# EasyEDA schematic rapoukBoardv6.json
TITLE: rapoukBoardv3; REV: 0.0; Date: 28-04-24; Sheet: 1/1; Drawn By: Roman Suk; Company: Suk Industries
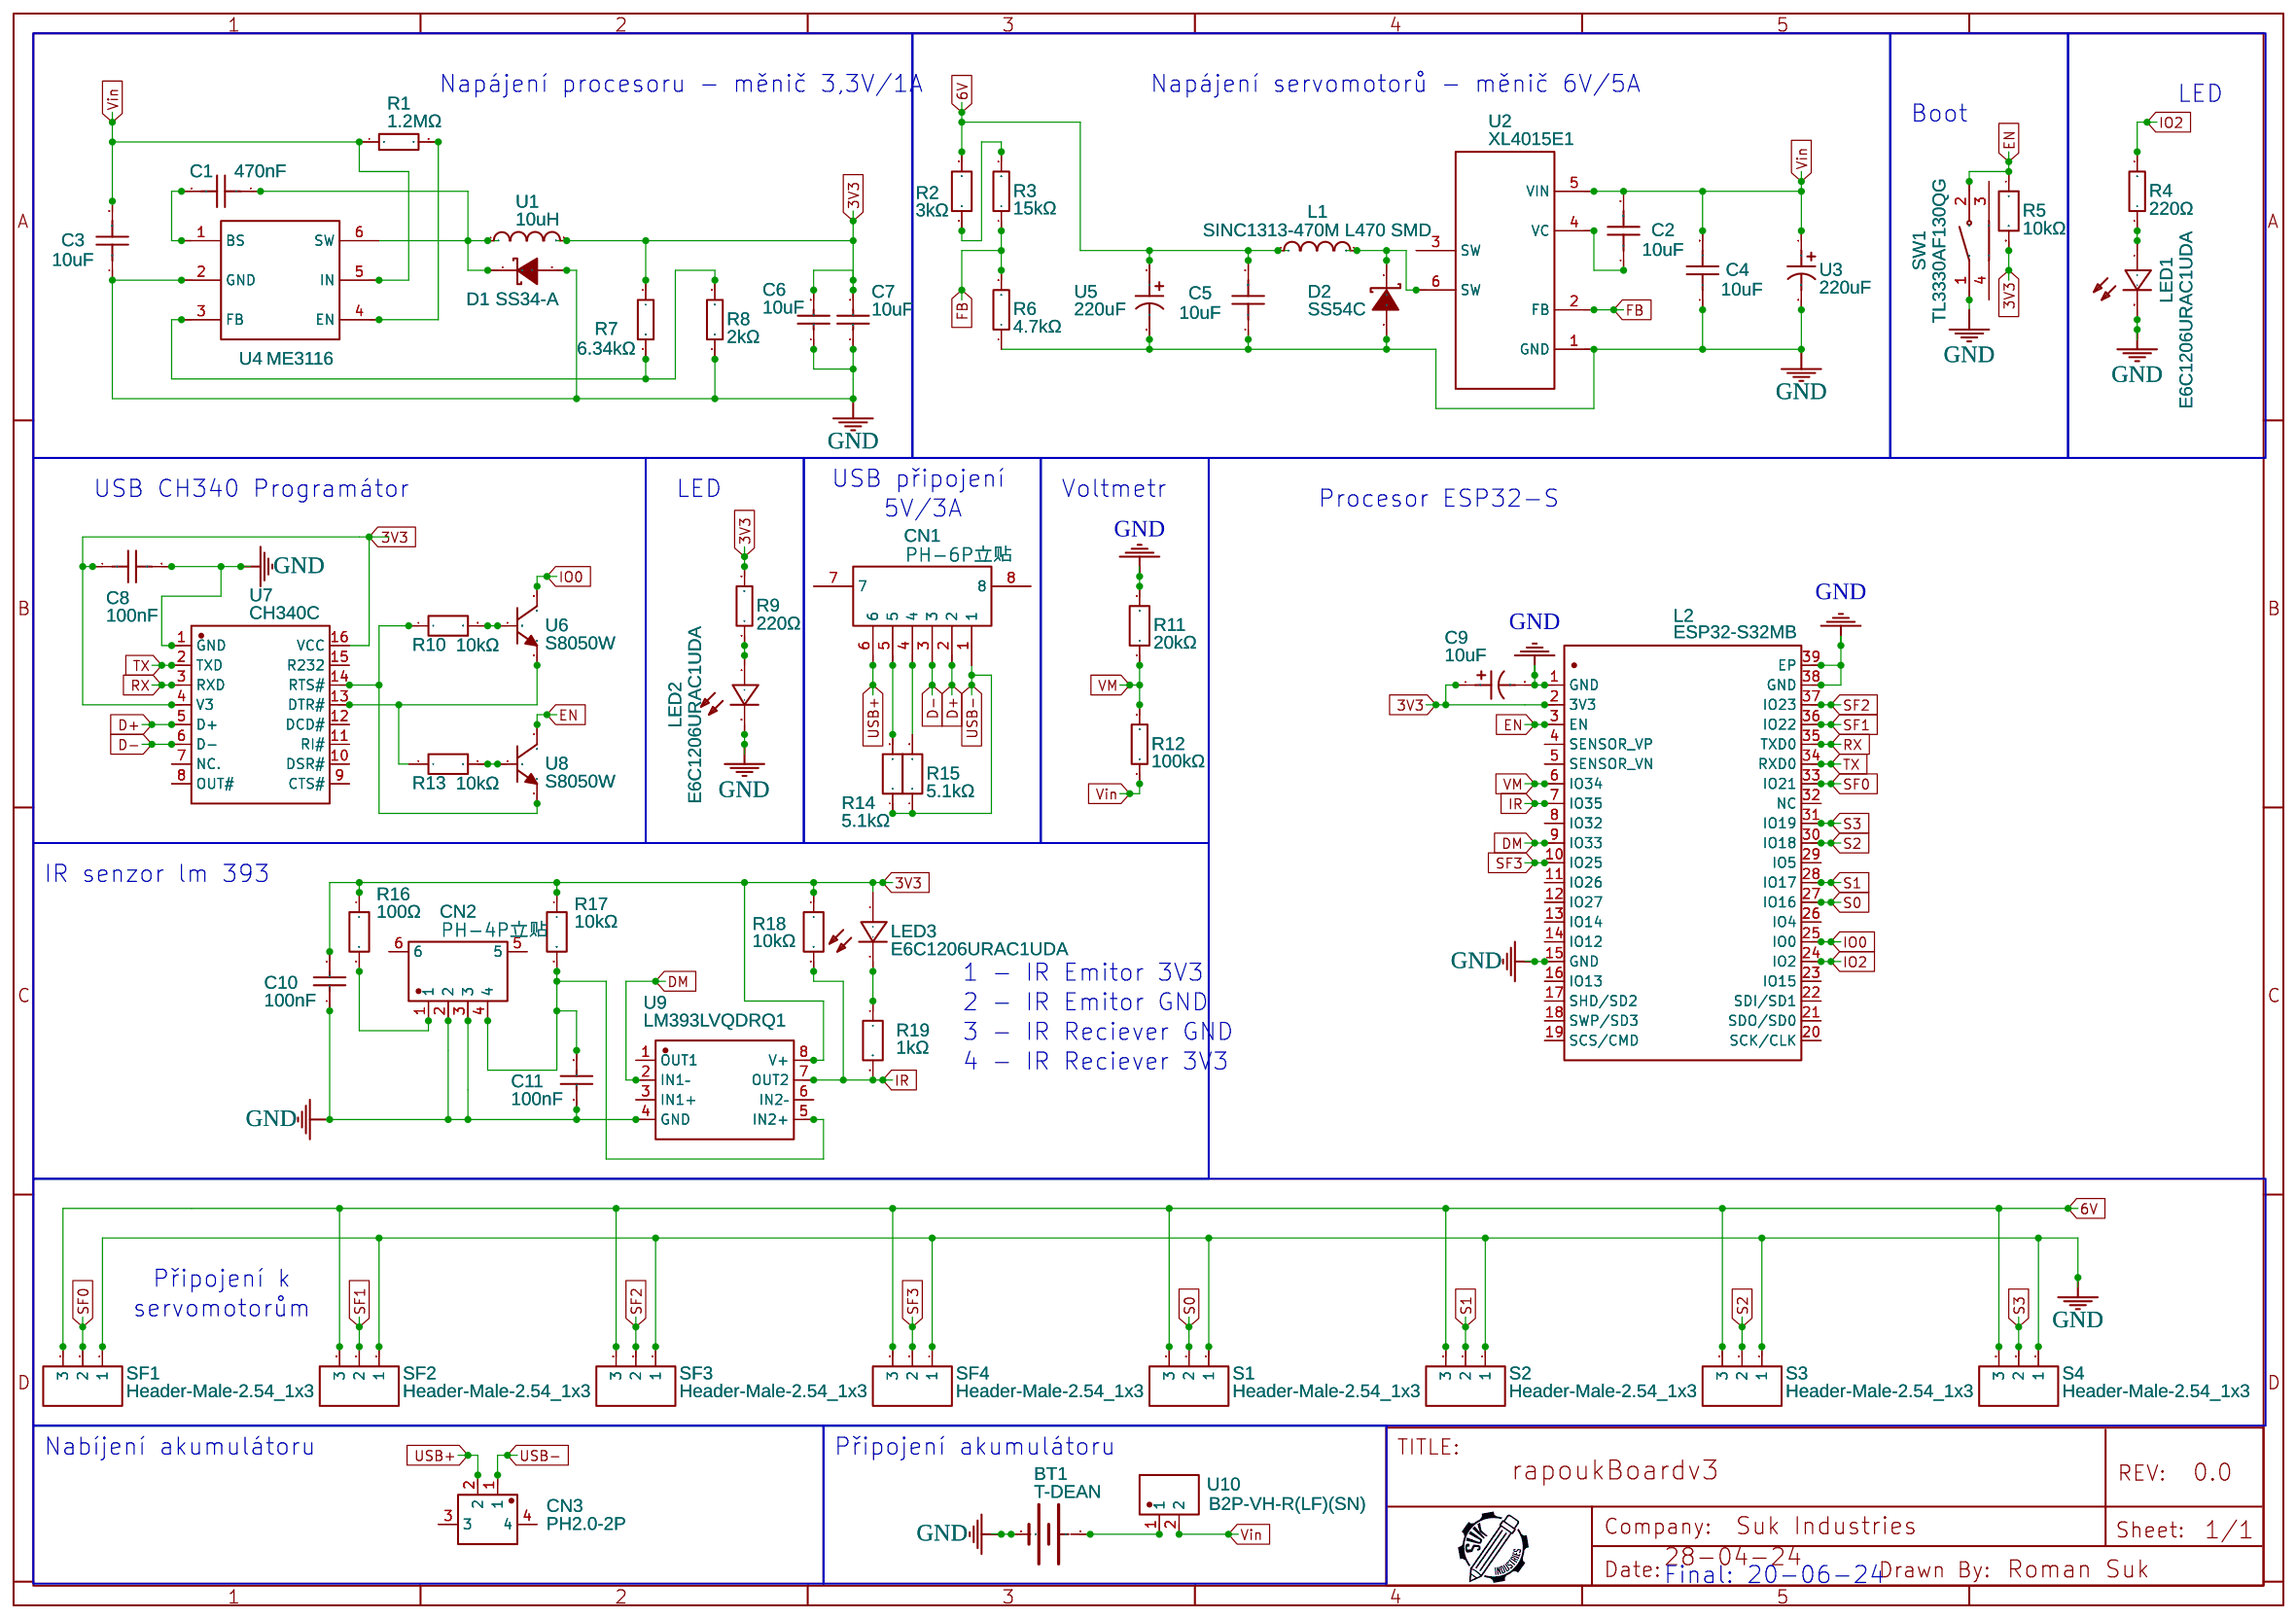
[diagram p0: schematic sheet]

## Parts
BT1  T-DEAN  [T_DEAN]
C1  470nF  [C1206]
C2  10uF  [C1206]
C3  10uF  [C1206]
C4  10uF  [C1206]
C5  10uF  [C1206]
C6  10uF  [C1206]
C7  10uF  [C1206]
C8  100nF  [C1206]
C9  10uF  [CAP-SMD_BD4.0-L4.3-W4.3-FD]
C10  100nF  [C1206]
C11  100nF  [C1206]
CN1  PH-6P立贴  [CONN-SMD_6P-P2.0-L14.0-W5.4]
CN2  PH-4P立贴  [CONN-SMD_PH2.0-4P]
CN3  PH2.0-2P  [CONN-SMD_PH2.0-1X2PW]
D1  SS34-A  [SMA_L4.3-W2.6-LS5.2-RD]
D2  SS54C  [SMC_L7.5-W5.8-LS8.3-RD]
L1  SINC1313-470M L470 SMD  [SINC1313]
L2  ESP32-S32MB  [WIFIM-SMD_ESP32-S32MB]
LED1  E6C1206URAC1UDA  [LED1206-R-RD_RED]
LED2  E6C1206URAC1UDA  [LED1206-R-RD_RED]
LED3  E6C1206URAC1UDA  [LED1206-R-RD_RED]
R1  1.2MΩ  [R1206]
R2  3kΩ  [R1206]
R3  15kΩ  [R1206]
R4  220Ω  [R1206]
R5  10kΩ  [R1206]
R6  4.7kΩ  [R1206]
R7  6.34kΩ  [R1206]
R8  2kΩ  [R1206]
R9  220Ω  [R1206]
R10  10kΩ  [R1206]
R11  20kΩ  [R1206]
R12  100kΩ  [R1206]
R13  10kΩ  [R1206]
R14  5.1kΩ  [R1206]
R15  5.1kΩ  [R1206]
R16  100Ω  [R1206]
R17  10kΩ  [R1206]
R18  10kΩ  [R1206]
R19  1kΩ  [R1206]
S1  Header-Male-2.54_1x3  [HDR-TH_3P-P2.54-V-M-1]
S2  Header-Male-2.54_1x3  [HDR-TH_3P-P2.54-V-M-1]
S3  Header-Male-2.54_1x3  [HDR-TH_3P-P2.54-V-M-1]
S4  Header-Male-2.54_1x3  [HDR-TH_3P-P2.54-V-M-1]
SF1  Header-Male-2.54_1x3  [HDR-TH_3P-P2.54-V-M-1]
SF2  Header-Male-2.54_1x3  [HDR-TH_3P-P2.54-V-M-1]
SF3  Header-Male-2.54_1x3  [HDR-TH_3P-P2.54-V-M-1]
SF4  Header-Male-2.54_1x3  [HDR-TH_3P-P2.54-V-M-1]
SW1  TL3330AF130QG  [SW-SMD_E-SWITCH_TL3330]
U1  10uH  [IND-SMD_L5.8-W5.2_CD54]
U2  XL4015E1  [TO-263-5_L10.2-W8.9-P1.70-TL]
U3  220uF  [CAP-SMD_BD6.3-L6.6-W6.6-FD]
U4  ME3116  [SOT-23-6_L2.9-W1.6-P0.95-LS2.8-BL]
U5  220uF  [CAP-SMD_BD6.3-L6.6-W6.6-FD]
U6  S8050W  [SOT-323-3_L2.1-W1.3-P1.30-LS2.3-BR]
U7  CH340C  [SOP-16_L10.0-W3.9-P1.27-LS6.0-BL]
U8  S8050W  [SOT-323-3_L2.1-W1.3-P1.30-LS2.3-BR]
U9  LM393LVQDRQ1  [SOIC-8_L4.9-W3.9-P1.27-LS6.0-BL]
U10  B2P-VH-R(LF)(SN)  [CONN-TH_B2P-VH-R]

## Library data of the parts
BT1 = T-DEAN: Contributor: michalklis
C1 = TCC1206X7R474K500FT: Contributor: LCSC; Supplier: LCSC; Supplier Part: C282872; Manufacturer: CCTC(三环); JLCPCB Part Class: Extended Part
C2-C5 = TCC1206X7R106K250HT: Contributor: LCSC; Supplier: LCSC; Supplier Part: C380364; Manufacturer: CCTC(三环); JLCPCB Part Class: Extended Part
C6 C7 = TMK316B7106KL-TD: Supplier: LCSC; Manufacturer: TAIYO YUDEN(太诱); Supplier Part: C92831; JLCPCB Part Class: Extended Part
C8 = 1206Y1000104KXR: Contributor: LCSC; Supplier: LCSC; Supplier Part: C2319128; Manufacturer: Knowles(楼氏); JLCPCB Part Class: Extended Part
C9 = RST10UF16V013: Supplier: LCSC; Supplier Part: C4747968; Manufacturer: KNSCHA(科尼盛); JLCPCB Part Class: Extended Part; Contributor: lcsc
C10 C11 = C1206X104K451T: Supplier: LCSC; Manufacturer: IHHEC(禾伸堂); Supplier Part: C106025; JLCPCB Part Class: Extended Part
CN1 = PH-6P立贴: Contributor: LCSC; Supplier: LCSC; Supplier Part: C64659; Manufacturer: BOOMELE(博穆精密); JLCPCB Part Class: Extended Part
CN2 = PH-4P立贴: Contributor: LCSC; Supplier: LCSC; Supplier Part: C67258; Manufacturer: BOOMELE(博穆精密); JLCPCB Part Class: Extended Part
CN3 = PH2.0-2P: Contributor: LCSC; Supplier: LCSC; Manufacturer: BOOMELE(博穆精密); Manufacturer Part: PH-2P立贴; Supplier Part: C64658; JLCPCB Part Class: Extended Part
D1 = SS34-A: Contributor: LCSC; Supplier: LCSC; Supplier Part: C143201; Manufacturer: FMS(美丽微); JLCPCB Part Class: Extended Part
D2 = SS54C: Contributor: LCSC; Supplier: LCSC; Supplier Part: C330398; Manufacturer: LGE(鲁光); Manufacturer Part: SS54; JLCPCB Part Class: Extended Part
L1 = SINC1313-470M L470 SMD: link: https://vi.aliexpress.com/item/1005006932666277.html?spm=a2g0o.productlist.main.1.240cENmjENmj9N&algo_pvid=bf29db7b-fa88-44d8-ba6d-a49f370a463e&algo_exp_id=bf29db7b-fa88-44d8-ba6d-a49f370a463e-0&pdp_npi=4%40dis%21USD%215.23%214.60%21%21%2137.50%2133.00%21%40210313e917158827587508967e9ebd%2112000038772414878%21sea%21CZ%210%21AB&curPageLogUid=HUxgkZ86eIhu&utparam-url=scene%3Asearch%7Cquery_from%3A; Contributor: romansuk05
L2 = ESP32-S32MB: Contributor: LCSC; Supplier: LCSC; Supplier Part: C2764096; Manufacturer: Ai-Thinker(安信可); Manufacturer Part: ESP32-S32Mb; JLCPCB Part Class: Extended Part
LED1-LED3 = E6C1206URAC1UDA: Contributor: LCSC; Supplier: LCSC; Supplier Part: C375458; Manufacturer: ekinglux(亿晶源); JLCPCB Part Class: Extended Part
R1 = WR12W1204FTL: Contributor: LCSC; Supplier: LCSC; Manufacturer: Walsin(华新科); Supplier Part: C171052; JLCPCB Part Class: Extended Part
R2 = CR1206J3K00P05Z: Contributor: LCSC; Supplier: LCSC; Supplier Part: C881253; Manufacturer: EVER OHMS(天二科技); JLCPCB Part Class: Extended Part
R3 = RT1206FRD0715KL: Contributor: LCSC; Supplier: LCSC; Manufacturer: YAGEO(国巨); Supplier Part: C136874; JLCPCB Part Class: Extended Part
R4 R9 = AECR1206F220RK9: Contributor: LCSC; Supplier: LCSC; Supplier Part: C352117; Manufacturer: RESI(开步睿思）; JLCPCB Part Class: Extended Part
R5 R10 R13 R17 R18 = SCR1206F10K: Supplier: LCSC; Supplier Part: C3017025; Manufacturer: VO(翔胜); JLCPCB Part Class: Extended Part; Contributor: lcsc
R6 = CRCW12064K70FKEA: Contributor: LCSC; Supplier: LCSC; Supplier Part: C242482; Manufacturer: VISHAY(威世); JLCPCB Part Class: Extended Part
R7 = RS-06K6341FT: Contributor: LCSC; Supplier: LCSC; Supplier Part: C323116; Manufacturer: FH(风华); JLCPCB Part Class: Extended Part
R8 = RTT06202JTP: Supplier: LCSC; Manufacturer: RALEC(旺诠); Supplier Part: C104689; JLCPCB Part Class: Extended Part
R11 = CR1206F20KP05: Contributor: LCSC; Supplier: LCSC; Supplier Part: C429423; Manufacturer: EVER OHMS(天二科技); JLCPCB Part Class: Extended Part
R12 = QR1206F100KP05: Contributor: LCSC; Supplier: LCSC; Supplier Part: C176233; Manufacturer: EVER OHMS(天二科技); Manufacturer Part: QR1206F100KP05Z; JLCPCB Part Class: Extended Part
R14 R15 = RT1206BRD075KL: Supplier: LCSC; Supplier Part: C870818; Manufacturer: YAGEO(国巨); JLCPCB Part Class: Extended Part; Contributor: lcsc
R16 = SCR1206F100R: Contributor: lcsc; Supplier: LCSC; Supplier Part: C3017190; Manufacturer: VO(翔胜); JLCPCB Part Class: Extended Part
R19 = SCR1206J1K: Contributor: lcsc; Supplier: LCSC; Supplier Part: C3018015; Manufacturer: VO(翔胜); JLCPCB Part Class: Extended Part
S1-S4 SF1-SF4 = Header-Male-2.54_1x3: Supplier: LCSC; Manufacturer: BOOMELE(博穆精密); Manufacturer Part: 2.54-1*3P针; Supplier Part: C49257; JLCPCB Part Class: Extended Part
SW1 = TL3330AF130QG: Contributor: LCSC; Supplier: LCSC; Supplier Part: C2886885; Manufacturer: E-Switch; JLCPCB Part Class: Extended Part
U1 = CD54YP0504-100M: Contributor: lcsc; Supplier: LCSC; Supplier Part: C492291; Manufacturer: YJYCOIN(益嘉源); JLCPCB Part Class: Extended Part
U2 = XL4015E1: Supplier: LCSC; Manufacturer: XLSEMI(芯龙); Supplier Part: C51661; JLCPCB Part Class: Extended Part
U3 U5 = CK220UF16V167RV0142: Supplier: LCSC; Supplier Part: C5246590; Manufacturer: KNSCHA(科尼盛); JLCPCB Part Class: Extended Part; Contributor: lcsc
U4 = ME3116: Supplier: LCSC; Manufacturer: MICRONE(南京微盟); Manufacturer Part: ME3116AM6G; Supplier Part: C97643; JLCPCB Part Class: Extended Part
U6 U8 = S8050W: Contributor: lcsc; Supplier: LCSC; Supplier Part: C5186011; Manufacturer: Slkor(萨科微)
U7 = CH340C: Supplier: LCSC; Manufacturer: WCH(南京沁恒); Supplier Part: C84681; JLCPCB Part Class: Extended Part
U9 = LM393LVQDRQ1: Contributor: lcsc; Supplier: LCSC; Supplier Part: C3039507; Manufacturer: TI(德州仪器); JLCPCB Part Class: Extended Part
U10 = B2P-VH-R(LF)(SN): Contributor: LCSC; Supplier: LCSC; Supplier Part: C265357; Manufacturer: JST; JLCPCB Part Class: Extended Part

## Nets
3V3: C6.2 C7.2 C8.1 C9.1 C10.2 L2.2(3V3) LED3.1(+) R5.2 R7.1 R9.2 R16.1 R17.1 R18.1 U1.2 U7.4(V3) U7.16(VCC) U9.8(V+)
6V: C5.2 L1.1 R2.2 S1.3 S2.3 S3.3 S4.3 SF1.3 SF2.3 SF3.3 SF4.3 U5.1
GND: BT1.2 C3.1 C4.1 C5.1 C6.1 C7.1 C8.2 C9.2 C10.1 C11.1 CN2.2 CN2.3 D1.2(A) D2.2(A) L2.1(GND) L2.15(GND) L2.38(GND) L2.39(EP) LED1.2(-) LED2.2(-) R6.1 R8.1 R11.2 S1.1 S2.1 S3.1 S4.1 SF1.1 SF2.1 SF3.1 SF4.1 SW1.1 U2.1(GND) U3.2 U4.2(GND) U5.2 U7.1(GND) U9.4(GND)
Vin: C2.2 C3.2 C4.2 R1.1 R12.1 U2.5(VIN) U3.1 U4.5(IN) U10.2
D+: CN1.2 U7.5(D+)
D-: CN1.3 U7.6(D-)
DM: L2.9(IO33) U9.2(IN1–)
EN: L2.3(EN) R5.1 SW1.2 U8.3(C)
FB: R3.1 R6.2 U2.2(FB)
IO0: L2.25(IO0) U6.3(C)
IO2: L2.24(IO2) R4.2
IR: L2.7(IO35) R18.2 R19.2 U9.7(OUT2)
RX: L2.35(TXD0) U7.3(RXD)
S0: L2.27(IO16) S1.2
S1: L2.28(IO17) S2.2
S2: L2.30(IO18) S3.2
S3: L2.31(IO19) S4.2
SF0: L2.33(IO21) SF1.2
SF1: L2.36(IO22) SF2.2
SF2: L2.37(IO23) SF3.2
SF3: L2.10(IO25) SF4.2
TX: L2.34(RXD0) U7.2(TXD)
USB+: CN1.6 CN3.2
USB-: CN1.1 CN3.1 R14.1 R15.1
VM: L2.6(IO34) R11.1 R12.2
Net-(BT1-1): BT1.1 U10.1
Net-(C1-1): C1.1 D1.1(C) U1.1 U4.6(SW)
Net-(C1-2): C1.2 U4.1(BS)
Net-(C2-1): C2.1 U2.4(VC)
Net-(C11-2): C11.2 CN2.4 R17.2 U9.5(IN2+)
Net-(CN1-4): CN1.4 R15.2
Net-(CN1-5): CN1.5 R14.2
Net-(CN2-1): CN2.1 R16.2
Net-(D2-1): D2.1(K) L1.2 U2.6(SW)
Net-(LED1-1): LED1.1(+) R4.1
Net-(LED2-1): LED2.1(+) R9.1
Net-(LED3-2): LED3.2(-) R19.1
Net-(R1-2): R1.2 U4.4(EN)
Net-(R2-1): R2.1 R3.2
Net-(R7-2): R7.2 R8.2 U4.3(FB)
Net-(R10-1): R10.1 U7.14(RTS#) U8.2(E)
Net-(R10-2): R10.2 U6.1(B)
Net-(R13-1): R13.1 U6.2(E) U7.13(DTR#)
Net-(R13-2): R13.2 U8.1(B)

Not connected (* = marked no-connect by the designer): CN1 7 8; CN2 5 6; CN3 3 4; L2 4(SENSOR_VP) 5(SENSOR_VN) 8(IO32) 11(IO26) 12(IO27) 13(IO14) 14(IO12) 16(IO13) 17(SHD/SD2) 18(SWP/SD3) 19(SCS/CMD) 20(SCK/CLK) 21(SDO/SD0) 22(SDI/SD1) 23(IO15) 26(IO4) 29(IO5) 32(NC); SW1 3 4; U2 3(SW); U7 7(NC.) 8(OUT#) 9(CTS#) 10(DSR#) 11(RI#) 12(DCD#) 15(R232); U9 1(OUT1) 3(IN1+) 6(IN2–)

## Notes on the sheet
- Napájení procesoru - měnič 3,3V/1A
- Napájení servomotorů - měnič 6V/5A
- LED
- Boot
- USB CH340 Programátor
- LED
- USB připojení
- Voltmetr
- Procesor ESP32-S
- 5V/3A
- IR senzor lm 393
- 1 - IR Emitor 3V3
- 2 - IR Emitor GND
- 3 - IR Reciever GND
- 4 - IR Reciever 3V3
- Připojení k
- servomotorům
- Nabíjení akumulátoru
- Připojení akumulátoru
- Final: 20-06-24
